# Altium schematic sheet P01_COVER.SchDoc
size 420 x 297 mm
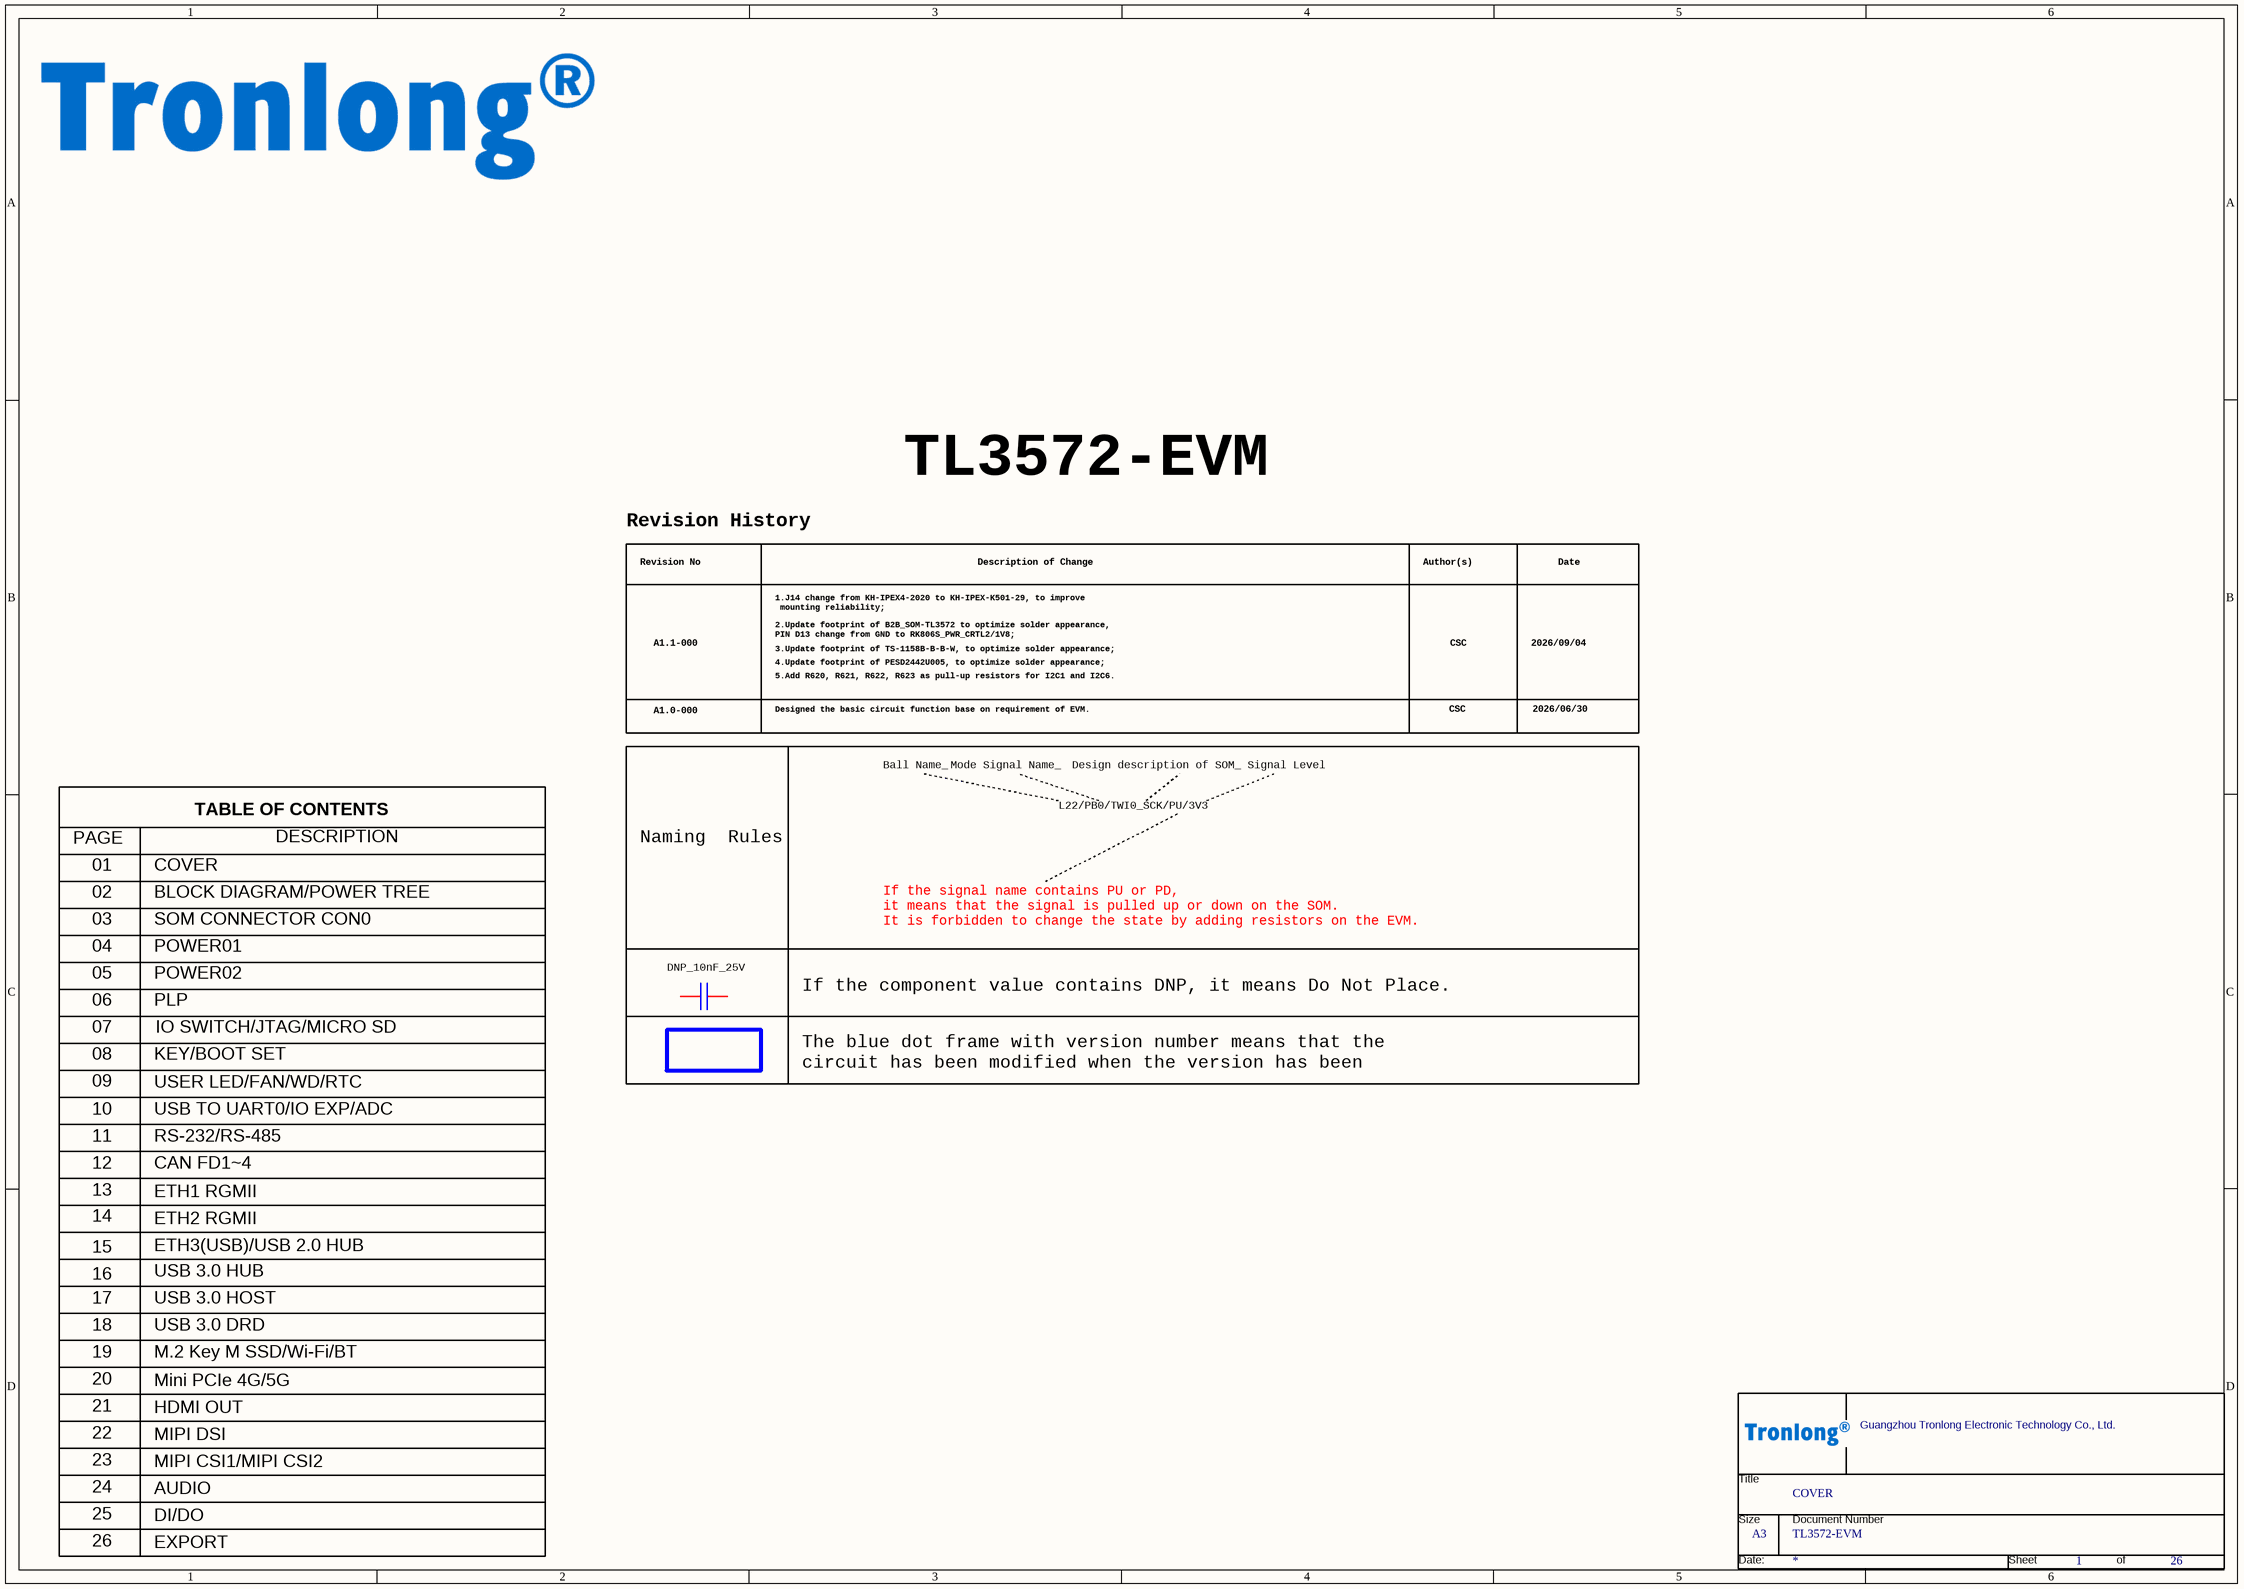
[diagram p0: P01_COVER.SchDoc]

## Parts
*  Page Count: 26  Page Number: 1  Page Size: A3  OrgName: Guangzhou Tronlong Electronic Technology Co., Ltd.  Title: COVER  Doc: TL3572-EVM  (hidden comment: TL_NEW)  (graphical)

## Notes on the sheet
- Revision History
- TL3572-EVM
- Revision No
- Description of Change
- Author(s)
- Date
- A1.1-000
- 2.Update footprint of B2B_SOM-TL3572 to optimize solder appearance,
  PIN D13 change from GND to RK806S_PWR_CRTL2/1V8;
- 3.Update footprint of TS-1158B-B-B-W, to optimize solder appearance;
- 4.Update footprint of PESD2442U005, to optimize solder appearance;
- 1.J14 change from KH-IPEX4-2020 to KH-IPEX-K501-29, to improve
  mounting reliability;
- CSC
- 2026/09/04
- A1.0-000
- Designed the basic circuit function base on requirement of EVM.
- 5.Add R620, R621, R622, R623 as pull-up resistors for I2C1 and I2C6.
- 2026/06/30
- Ball Name_
- Mode Signal Name_
- Design description of SOM_
- Signal Level
- PAGE
- TABLE OF CONTENTS
- DESCRIPTION
- Naming  Rules
- L22/PB0/TWI0_SCK/PU/3V3
- 02
- 03
- 01
- BLOCK DIAGRAM/POWER TREE
- COVER
- SOM CONNECTOR CON0
- If the signal name contains PU or PD,
  it means that the signal is pulled up or down on the SOM.
  It is forbidden to change the state by adding resistors on the EVM.
- 04
- 05
- POWER01
- POWER02
- DNP_10nF_25V
- If the component value contains DNP, it means Do Not Place.
- 08
- 07
- 06
- PLP
- KEY/BOOT SET
- IO SWITCH/JTAG/MICRO SD
- The blue dot frame with version number means that the
  circuit has been modified when the version has been upgraded.
- 09
- 10
- USER LED/FAN/WD/RTC
- USB TO UART0/IO EXP/ADC
- 11
- 13
- 12
- ETH1 RGMII
- RS-232/RS-485
- CAN FD1~4
- 14
- 15
- ETH2 RGMII
- ETH3(USB)/USB 2.0 HUB
- 16
- 18
- 17
- USB 3.0 HUB
- USB 3.0 HOST
- USB 3.0 DRD
- 20
- 19
- Mini PCIe 4G/5G
- M.2 Key M SSD/Wi-Fi/BT
- 21
- 22
- 23
- HDMI OUT
- MIPI DSI
- MIPI CSI1/MIPI CSI2
- 24
- 25
- AUDIO
- DI/DO
- 26
- EXPORT
- (in symbol TL_NEW) Title; Size; Document Number; Date:; Sheet; of

## Library data of the parts
* = TL_NEW: RevCode: A?; Page Create Date: March  8, 1995; Page Modify Date: *; Document: TL3572-EVM